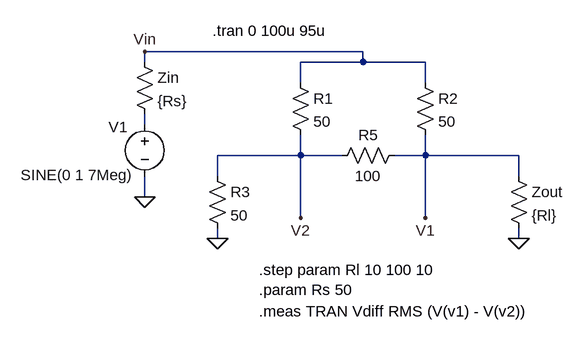
[diagram p0: schematic SWR Wheatstone Bridge w Detector.asc]
SWR Wheatstone Bridge w Detector.asc, the LTspice schematic file:
Version 4
SHEET 1 1580 680
WIRE 304 -176 -32 -176
WIRE -32 -160 -32 -176
WIRE 304 -160 304 -176
WIRE 304 -160 208 -160
WIRE 400 -160 304 -160
WIRE 208 -128 208 -160
WIRE 400 -128 400 -160
WIRE -32 -64 -32 -80
WIRE 208 -16 208 -48
WIRE 208 -16 80 -16
WIRE 272 -16 208 -16
WIRE 400 -16 400 -48
WIRE 400 -16 352 -16
WIRE 544 -16 400 -16
WIRE 80 16 80 -16
WIRE 544 16 544 -16
WIRE -32 48 -32 16
WIRE 208 80 208 -16
WIRE 400 80 400 -16
WIRE 80 112 80 96
WIRE 544 112 544 96
FLAG -32 48 0
FLAG -32 -176 Vin
FLAG 544 112 0
FLAG 80 112 0
FLAG 208 80 V2
FLAG 400 80 V1
SYMBOL voltage -32 -80 R0
WINDOW 0 -56 20 Left 2
WINDOW 3 -191 94 Left 2
WINDOW 123 0 0 Left 0
WINDOW 39 0 0 Left 0
SYMATTR InstName V1
SYMATTR Value SINE(0 1 7Meg)
SYMBOL res 528 0 R0
SYMATTR InstName Zout
SYMATTR Value {Rl}
SYMBOL res -48 -176 R0
SYMATTR InstName Zin
SYMATTR Value {Rs}
SYMBOL res 192 -144 R0
SYMATTR InstName R1
SYMATTR Value 50
SYMBOL res 384 -144 R0
SYMATTR InstName R2
SYMATTR Value 50
SYMBOL res 64 0 R0
SYMATTR InstName R3
SYMATTR Value 50
SYMBOL res 368 -32 R90
WINDOW 0 0 56 VBottom 2
WINDOW 3 32 56 VTop 2
SYMATTR InstName R5
SYMATTR Value 100
TEXT 144 160 Left 2 !.step param Rl 10 100 10\n.param Rs 50
TEXT 72 -208 Left 2 !.tran 0 100u 95u
TEXT 144 224 Left 2 !.meas TRAN Vdiff RMS (V(v1) - V(v2))

The netlist it stands for:
* SWR Wheatstone Bridge w Detector.asc
V1 N001 0 SINE(0 1 7Meg)
R§Zout V1 0 {Rl}
R§Zin Vin N001 {Rs}
R1 Vin V2 50
R2 Vin V1 50
R3 V2 0 50
R5 V1 V2 100
.step param Rl 10 100 10
.param Rs 50
.tran 0 100u 95u
.meas TRAN Vdiff RMS (V(v1) - V(v2))
.backanno
.end